# EAGLE schematic ultraino (EAGLE 8.3.2)
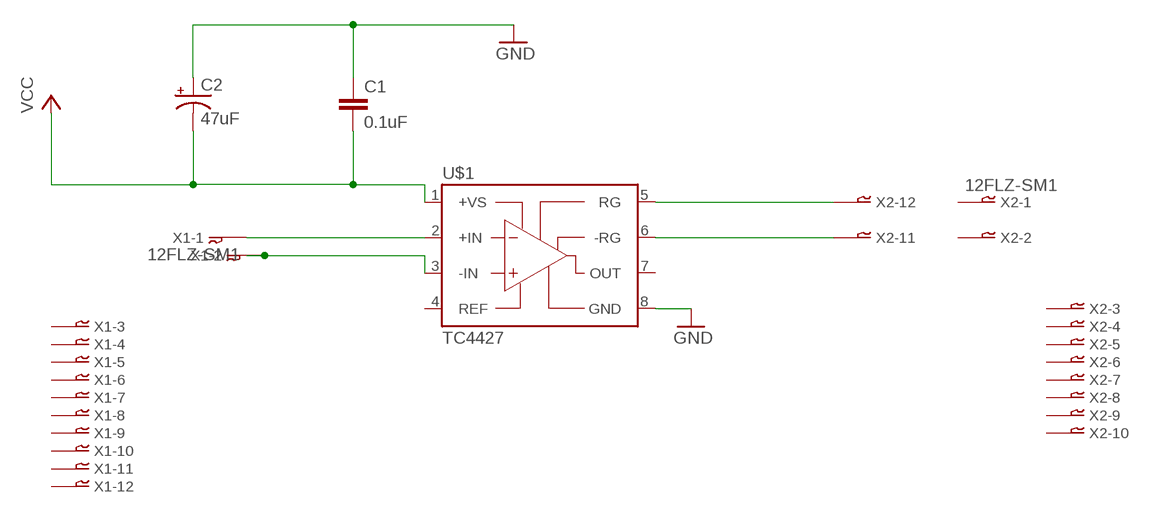
[diagram p0: schematic, sheet 1]

## Parts
C1  0.1uF  0.1UF-0402-16V-10%  [0402]
C2  47uF  47UF-POLAR-EIA3528-10V-10%  [EIA3528]
U$1  TC4427  [SOIC-8]
X1  12FLZ-SM1  [12FLZ-SM]
X2  12FLZ-SM1  [12FLZ-SM]

## Nets
GND [GND]: C1.1 C2.A(+) U$1.8(GND)
N$1 [GND]: U$1.2(+IN) X1.1
N$2 [GND]: U$1.3(-IN) X1.2
N$3: U$1.5(RG) X2.12
N$4: U$1.6(-RG) X2.11
VCC [GND]: C1.2 C2.C(-) U$1.1(+VS)
Unconnected: U$1.4(REF) U$1.7(OUT) X1.3 X1.4 X1.5 X1.6 X1.7 X1.8 X1.9 X1.10 X1.11 X1.12 X2.1 X2.2 X2.3 X2.4 X2.5 X2.6 X2.7 X2.8 X2.9 X2.10

## Library data of the parts
C1 = capacitor:0.1UF: 0.1�F ceramic capacitors A capacitor is a passive two-terminal electrical component used to store electrical energy temporarily in an electric field.; PROD_ID: CAP-12416
C2 = capacitor:47UF-POLAR: 47�F polarized capacitors A capacitor is a passive two-terminal electrical component used to store electrical energy temporarily in an electric field.; PROD_ID: CAP-08310
U$1 = example:TC4427
X1 X2 = con-jst:12FLZ-SM1: CONNECTOR; OC_FARNELL: unknown; OC_NEWARK: unknown

## Net classes
1 GND: width 0.635 mm